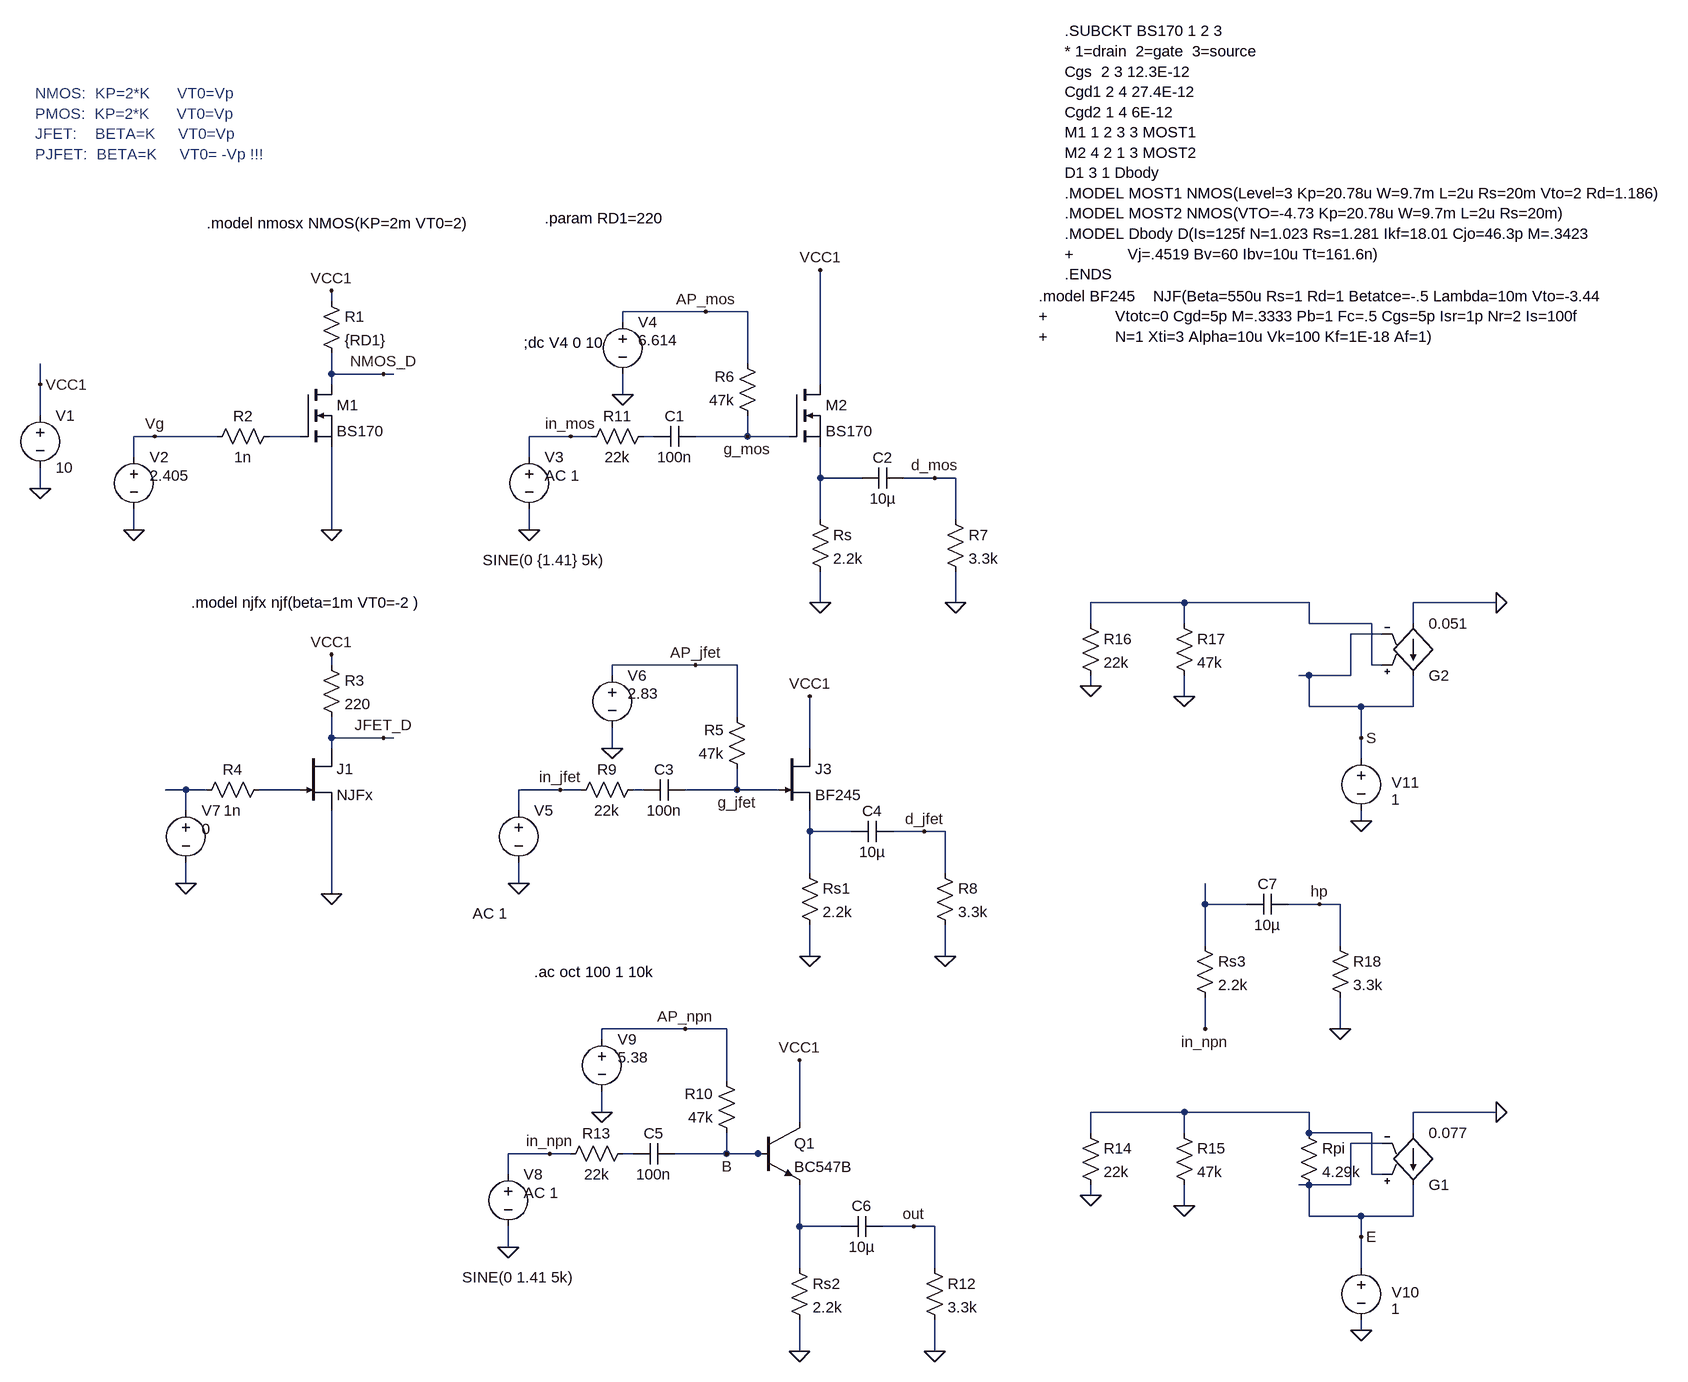
[diagram p0: schematic Sourcefolger.asc]
Sourcefolger.asc, the LTspice schematic file:
Version 4
SHEET 1 3376 2448
WIRE 1184 160 1184 144
WIRE 1760 176 1632 176
WIRE 1824 176 1760 176
WIRE 1632 192 1632 176
WIRE 1824 256 1824 176
WIRE 1184 272 1184 240
WIRE 1264 272 1184 272
WIRE 1280 272 1264 272
WIRE 736 288 736 256
WIRE 1184 288 1184 272
WIRE 1936 288 1936 112
WIRE 1632 304 1632 272
WIRE 736 336 736 288
WIRE 912 368 880 368
WIRE 1008 368 912 368
WIRE 1136 368 1088 368
WIRE 1552 368 1488 368
WIRE 1584 368 1552 368
WIRE 1680 368 1664 368
WIRE 1824 368 1824 336
WIRE 1824 368 1744 368
WIRE 1888 368 1824 368
WIRE 880 400 880 368
WIRE 1488 400 1488 368
WIRE 1936 432 1936 384
WIRE 2000 432 1936 432
WIRE 2112 432 2064 432
WIRE 2144 432 2112 432
WIRE 736 448 736 416
WIRE 1936 496 1936 432
WIRE 2144 496 2144 432
WIRE 880 512 880 480
WIRE 1184 512 1184 384
WIRE 1488 512 1488 480
WIRE 1936 624 1936 576
WIRE 2144 624 2144 576
WIRE 2496 624 2352 624
WIRE 2688 624 2496 624
WIRE 2976 624 2848 624
WIRE 2352 656 2352 624
WIRE 2496 656 2496 624
WIRE 2688 656 2688 624
WIRE 2784 656 2688 656
WIRE 2848 656 2848 624
WIRE 2800 672 2752 672
WIRE 1184 720 1184 704
WIRE 1744 720 1616 720
WIRE 1808 720 1744 720
WIRE 2784 720 2784 656
WIRE 2800 720 2784 720
WIRE 1616 736 1616 720
WIRE 2688 736 2672 736
WIRE 2752 736 2752 672
WIRE 2752 736 2688 736
WIRE 2352 752 2352 736
WIRE 2496 768 2496 736
WIRE 2688 784 2688 736
WIRE 2768 784 2688 784
WIRE 2848 784 2848 736
WIRE 2848 784 2768 784
WIRE 1808 800 1808 720
WIRE 1184 832 1184 800
WIRE 1264 832 1184 832
WIRE 1280 832 1264 832
WIRE 2768 832 2768 784
WIRE 1184 848 1184 832
WIRE 1616 848 1616 816
WIRE 1920 848 1920 768
WIRE 2768 864 2768 832
WIRE 960 912 928 912
WIRE 992 912 960 912
WIRE 1136 912 1072 912
WIRE 1536 912 1472 912
WIRE 1568 912 1536 912
WIRE 1664 912 1648 912
WIRE 1808 912 1808 880
WIRE 1808 912 1728 912
WIRE 1872 912 1808 912
WIRE 960 944 960 912
WIRE 1472 944 1472 912
WIRE 2768 960 2768 944
WIRE 1920 976 1920 944
WIRE 1984 976 1920 976
WIRE 2096 976 2048 976
WIRE 2128 976 2096 976
WIRE 1920 1040 1920 976
WIRE 2128 1040 2128 976
WIRE 960 1056 960 1024
WIRE 1472 1056 1472 1024
WIRE 1184 1072 1184 944
WIRE 2528 1088 2528 1056
WIRE 2592 1088 2528 1088
WIRE 2704 1088 2656 1088
WIRE 2736 1088 2704 1088
WIRE 2528 1152 2528 1088
WIRE 2736 1152 2736 1088
WIRE 1920 1168 1920 1120
WIRE 2128 1168 2128 1120
WIRE 1728 1280 1600 1280
WIRE 1792 1280 1728 1280
WIRE 2528 1280 2528 1232
WIRE 2736 1280 2736 1232
WIRE 1600 1296 1600 1280
WIRE 1792 1360 1792 1280
WIRE 1600 1408 1600 1376
WIRE 2496 1408 2352 1408
WIRE 2688 1408 2496 1408
WIRE 2976 1408 2848 1408
WIRE 1904 1424 1904 1328
WIRE 2352 1440 2352 1408
WIRE 2496 1440 2496 1408
WIRE 2688 1440 2688 1408
WIRE 2784 1440 2688 1440
WIRE 2848 1440 2848 1408
WIRE 2800 1456 2752 1456
WIRE 1520 1472 1456 1472
WIRE 1552 1472 1520 1472
WIRE 1648 1472 1632 1472
WIRE 1792 1472 1792 1440
WIRE 1792 1472 1712 1472
WIRE 1840 1472 1792 1472
WIRE 1856 1472 1840 1472
WIRE 1456 1504 1456 1472
WIRE 2784 1504 2784 1440
WIRE 2800 1504 2784 1504
WIRE 2688 1520 2672 1520
WIRE 2752 1520 2752 1456
WIRE 2752 1520 2688 1520
WIRE 2352 1536 2352 1520
WIRE 2496 1552 2496 1520
WIRE 2688 1568 2688 1520
WIRE 2768 1568 2688 1568
WIRE 2848 1568 2848 1520
WIRE 2848 1568 2768 1568
WIRE 1904 1584 1904 1520
WIRE 1968 1584 1904 1584
WIRE 2080 1584 2032 1584
WIRE 2112 1584 2080 1584
WIRE 2768 1600 2768 1568
WIRE 1456 1616 1456 1584
WIRE 1904 1648 1904 1584
WIRE 2112 1648 2112 1584
WIRE 2768 1648 2768 1600
WIRE 2768 1744 2768 1728
WIRE 1904 1776 1904 1728
WIRE 2112 1776 2112 1728
FLAG 1184 512 0
FLAG 736 448 0
FLAG 880 512 0
FLAG 736 288 VCC1
FLAG 1184 144 VCC1
FLAG 1184 1072 0
FLAG 1184 704 VCC1
FLAG 912 368 Vg
FLAG 1264 832 JFET_D
FLAG 1264 272 NMOS_D
FLAG 1936 624 0
FLAG 1488 512 0
FLAG 1936 112 VCC1
FLAG 1632 304 0
FLAG 1760 176 AP_mos
FLAG 1824 368 g_mos
FLAG 2112 432 d_mos
FLAG 1552 368 in_mos
FLAG 2144 624 0
FLAG 960 1056 0
FLAG 1920 1168 0
FLAG 1472 1056 0
FLAG 1920 768 VCC1
FLAG 1616 848 0
FLAG 1744 720 AP_jfet
FLAG 1808 912 g_jfet
FLAG 2096 976 d_jfet
FLAG 1536 912 in_jfet
FLAG 2128 1168 0
FLAG 1904 1776 0
FLAG 1456 1616 0
FLAG 1904 1328 VCC1
FLAG 1600 1408 0
FLAG 1728 1280 AP_npn
FLAG 1792 1472 B
FLAG 2080 1584 out
FLAG 1520 1472 in_npn
FLAG 2112 1776 0
FLAG 2496 1552 0
FLAG 2352 1536 0
FLAG 2976 1408 0
FLAG 2768 1744 0
FLAG 2496 768 0
FLAG 2352 752 0
FLAG 2976 624 0
FLAG 2768 960 0
FLAG 2768 1600 E
FLAG 2768 832 S
FLAG 2704 1088 hp
FLAG 2736 1280 0
FLAG 2528 1280 in_npn
SYMBOL voltage 736 320 R0
WINDOW 123 0 0 Left 2
WINDOW 39 0 0 Left 2
SYMATTR InstName V1
SYMATTR Value 10
SYMBOL res 1168 144 R0
SYMATTR InstName R1
SYMATTR Value {RD1}
SYMBOL voltage 880 384 R0
WINDOW 123 0 0 Left 2
WINDOW 39 0 0 Left 2
WINDOW 3 24 44 Left 2
SYMATTR Value 2.405
SYMATTR InstName V2
SYMBOL res 1104 352 R90
WINDOW 0 0 56 VBottom 2
WINDOW 3 32 56 VTop 2
SYMATTR InstName R2
SYMATTR Value 1n
SYMBOL nmos 1136 288 R0
SYMATTR InstName M1
SYMATTR Value BS170
SYMATTR Prefix X
SYMBOL njf 1136 848 R0
SYMATTR InstName J1
SYMATTR Value NJFx
SYMBOL res 1168 704 R0
SYMATTR InstName R3
SYMATTR Value 220
SYMBOL res 1088 896 R90
WINDOW 0 0 56 VBottom 2
WINDOW 3 32 56 VTop 2
SYMATTR InstName R4
SYMATTR Value 1n
SYMBOL voltage 1488 384 R0
WINDOW 123 24 44 Left 2
WINDOW 39 0 0 Left 2
WINDOW 3 -71 174 Left 2
SYMATTR Value2 AC 1
SYMATTR Value SINE(0 {1.41} 5k)
SYMATTR InstName V3
SYMBOL res 1840 352 R180
WINDOW 0 36 76 Left 2
WINDOW 3 36 40 Left 2
SYMATTR InstName R6
SYMATTR Value 47k
SYMBOL cap 1744 352 R90
WINDOW 0 0 32 VBottom 2
WINDOW 3 32 32 VTop 2
SYMATTR InstName C1
SYMATTR Value 100n
SYMBOL voltage 1632 176 R0
WINDOW 123 0 0 Left 2
WINDOW 39 0 0 Left 2
WINDOW 3 24 44 Left 2
SYMATTR Value 6.614
SYMATTR InstName V4
SYMBOL cap 2064 416 R90
WINDOW 0 0 32 VBottom 2
WINDOW 3 32 32 VTop 2
SYMATTR InstName C2
SYMATTR Value 10µ
SYMBOL res 2128 480 R0
SYMATTR InstName R7
SYMATTR Value 3.3k
SYMBOL nmos 1888 288 R0
SYMATTR InstName M2
SYMATTR Value BS170
SYMATTR Prefix X
SYMBOL voltage 960 928 R0
WINDOW 123 0 0 Left 2
WINDOW 39 0 0 Left 2
WINDOW 3 24 44 Left 2
SYMATTR Value 0
SYMATTR InstName V7
SYMBOL res 1680 352 R90
WINDOW 0 0 56 VBottom 2
WINDOW 3 32 56 VTop 2
SYMATTR InstName R11
SYMATTR Value 22k
SYMBOL res 1920 480 R0
SYMATTR InstName Rs
SYMATTR Value 2.2k
SYMBOL voltage 1472 928 R0
WINDOW 123 0 0 Left 2
WINDOW 39 0 0 Left 2
WINDOW 3 -71 174 Left 2
SYMATTR Value AC 1
SYMATTR InstName V5
SYMBOL res 1824 896 R180
WINDOW 0 36 76 Left 2
WINDOW 3 36 40 Left 2
SYMATTR InstName R5
SYMATTR Value 47k
SYMBOL cap 1728 896 R90
WINDOW 0 0 32 VBottom 2
WINDOW 3 32 32 VTop 2
SYMATTR InstName C3
SYMATTR Value 100n
SYMBOL voltage 1616 720 R0
WINDOW 123 0 0 Left 2
WINDOW 39 0 0 Left 2
WINDOW 3 24 44 Left 2
SYMATTR Value 2.83
SYMATTR InstName V6
SYMBOL cap 2048 960 R90
WINDOW 0 0 32 VBottom 2
WINDOW 3 32 32 VTop 2
SYMATTR InstName C4
SYMATTR Value 10µ
SYMBOL res 2112 1024 R0
SYMATTR InstName R8
SYMATTR Value 3.3k
SYMBOL res 1664 896 R90
WINDOW 0 0 56 VBottom 2
WINDOW 3 32 56 VTop 2
SYMATTR InstName R9
SYMATTR Value 22k
SYMBOL res 1904 1024 R0
SYMATTR InstName Rs1
SYMATTR Value 2.2k
SYMBOL voltage 1456 1488 R0
WINDOW 123 24 44 Left 2
WINDOW 39 0 0 Left 2
WINDOW 3 -71 174 Left 2
SYMATTR Value2 AC 1
SYMATTR Value SINE(0 1.41 5k)
SYMATTR InstName V8
SYMBOL res 1808 1456 R180
WINDOW 0 36 76 Left 2
WINDOW 3 36 40 Left 2
SYMATTR InstName R10
SYMATTR Value 47k
SYMBOL cap 1712 1456 R90
WINDOW 0 0 32 VBottom 2
WINDOW 3 32 32 VTop 2
SYMATTR InstName C5
SYMATTR Value 100n
SYMBOL voltage 1600 1280 R0
WINDOW 123 0 0 Left 2
WINDOW 39 0 0 Left 2
WINDOW 3 24 44 Left 2
SYMATTR Value 5.38
SYMATTR InstName V9
SYMBOL cap 2032 1568 R90
WINDOW 0 0 32 VBottom 2
WINDOW 3 32 32 VTop 2
SYMATTR InstName C6
SYMATTR Value 10µ
SYMBOL res 2096 1632 R0
SYMATTR InstName R12
SYMATTR Value 3.3k
SYMBOL res 1648 1456 R90
WINDOW 0 0 56 VBottom 2
WINDOW 3 32 56 VTop 2
SYMATTR InstName R13
SYMATTR Value 22k
SYMBOL res 1888 1632 R0
SYMATTR InstName Rs2
SYMATTR Value 2.2k
SYMBOL npn 1840 1424 R0
SYMATTR InstName Q1
SYMATTR Value BC547B
SYMBOL njf 1872 848 R0
SYMATTR InstName J3
SYMATTR Value BF245
SYMBOL res 2336 1424 R0
SYMATTR InstName R14
SYMATTR Value 22k
SYMBOL res 2480 1424 R0
SYMATTR InstName R15
SYMATTR Value 47k
SYMBOL res 2672 1424 R0
SYMATTR InstName Rpi
SYMATTR Value 4.29k
SYMBOL g 2848 1536 M180
SYMATTR InstName G1
SYMATTR Value 0.077
SYMBOL voltage 2768 1632 R0
WINDOW 123 0 0 Left 2
WINDOW 39 0 0 Left 2
WINDOW 3 46 79 Left 2
WINDOW 0 47 53 Left 2
SYMATTR Value 1
SYMATTR InstName V10
SYMBOL res 2336 640 R0
SYMATTR InstName R16
SYMATTR Value 22k
SYMBOL res 2480 640 R0
SYMATTR InstName R17
SYMATTR Value 47k
SYMBOL g 2848 752 M180
SYMATTR InstName G2
SYMATTR Value 0.051
SYMBOL voltage 2768 848 R0
WINDOW 123 0 0 Left 2
WINDOW 39 0 0 Left 2
WINDOW 3 46 79 Left 2
WINDOW 0 47 53 Left 2
SYMATTR Value 1
SYMATTR InstName V11
SYMBOL cap 2656 1072 R90
WINDOW 0 0 32 VBottom 2
WINDOW 3 32 32 VTop 2
SYMATTR InstName C7
SYMATTR Value 10µ
SYMBOL res 2720 1136 R0
SYMATTR InstName R18
SYMATTR Value 3.3k
SYMBOL res 2512 1136 R0
SYMATTR InstName Rs3
SYMATTR Value 2.2k
TEXT 992 40 Left 2 !.model nmosx NMOS(KP=2m VT0=2)
TEXT 968 624 Left 2 !.model njfx njf(beta=1m VT0=-2 )
TEXT 728 -160 Left 2 ;NMOS:  KP=2*K      VT0=Vp\nPMOS:  KP=2*K      VT0=Vp\nJFET:    BETA=K     VT0=Vp\nPJFET:  BETA=K     VT0= -Vp !!!
TEXT 1512 32 Left 2 !.param RD1=220
TEXT 2312 -256 Left 2 !.SUBCKT BS170 1 2 3\n* 1=drain  2=gate  3=source\nCgs  2 3 12.3E-12\nCgd1 2 4 27.4E-12\nCgd2 1 4 6E-12\nM1 1 2 3 3 MOST1\nM2 4 2 1 3 MOST2\nD1 3 1 Dbody\n.MODEL MOST1 NMOS(Level=3 Kp=20.78u W=9.7m L=2u Rs=20m Vto=2 Rd=1.186)\n.MODEL MOST2 NMOS(VTO=-4.73 Kp=20.78u W=9.7m L=2u Rs=20m)\n.MODEL Dbody D(Is=125f N=1.023 Rs=1.281 Ikf=18.01 Cjo=46.3p M=.3423\n+            Vj=.4519 Bv=60 Ibv=10u Tt=161.6n)\n.ENDS
TEXT 2272 152 Left 2 !.model BF245    NJF(Beta=550u Rs=1 Rd=1 Betatce=-.5 Lambda=10m Vto=-3.44\n+               Vtotc=0 Cgd=5p M=.3333 Pb=1 Fc=.5 Cgs=5p Isr=1p Nr=2 Is=100f\n+               N=1 Xti=3 Alpha=10u Vk=100 Kf=1E-18 Af=1)
TEXT 1496 1192 Left 2 !.ac oct 100 1 10k
TEXT 1480 224 Left 2 !;dc V4 0 10

The netlist it stands for:
* Sourcefolger.asc
V1 VCC1 0 10
R1 VCC1 NMOS_D {RD1}
V2 Vg 0 2.405
R2 N001 Vg 1n
XM1 NMOS_D N001 0 BS170  ; pins D G S
J1 JFET_D N006 0 NJFx
R3 VCC1 JFET_D 220
R4 N006 N005 1n
V3 in_mos 0 SINE(0 {1.41} 5k) AC 1
R6 g_mos AP_mos 47k
C1 g_mos N002 100n
V4 AP_mos 0 6.614
C2 d_mos N003 10µ
R7 d_mos 0 3.3k
XM2 VCC1 g_mos N003 BS170  ; pins D G S
V7 N005 0 0
R11 N002 in_mos 22k
Rs N003 0 2.2k
V5 in_jfet 0 AC 1
R5 g_jfet AP_jfet 47k
C3 g_jfet N007 100n
V6 AP_jfet 0 2.83
C4 d_jfet N008 10µ
R8 d_jfet 0 3.3k
R9 N007 in_jfet 22k
Rs1 N008 0 2.2k
V8 in_npn 0 SINE(0 1.41 5k) AC 1
R10 B AP_npn 47k
C5 B N011 100n
V9 AP_npn 0 5.38
C6 out N012 10µ
R12 out 0 3.3k
R13 N011 in_npn 22k
Rs2 N012 0 2.2k
Q1 VCC1 B N012 0 BC547B
J3 VCC1 g_jfet N008 BF245
R14 N010 0 22k
R15 N010 0 47k
Rpi N010 E 4.29k
G1 0 E N010 E 0.077
V10 E 0 1
R16 N004 0 22k
R17 N004 0 47k
G2 0 S N004 S 0.051
V11 S 0 1
C7 hp N009 10µ
R18 hp 0 3.3k
Rs3 N009 in_npn 2.2k
.model NPN NPN
.model PNP PNP
.lib standard.bjt
.model NJF NJF
.model PJF PJF
.lib standard.jft
.model nmosx NMOS(KP=2m VT0=2)
.model njfx njf(beta=1m VT0=-2 )
* NMOS:  KP=2*K      VT0=Vp
* PMOS:  KP=2*K      VT0=Vp
* JFET:    BETA=K     VT0=Vp
* PJFET:  BETA=K     VT0= -Vp !!!
.param RD1=220
.SUBCKT BS170 1 2 3
* 1=drain  2=gate  3=source
Cgs  2 3 12.3E-12
Cgd1 2 4 27.4E-12
Cgd2 1 4 6E-12
M1 1 2 3 3 MOST1
M2 4 2 1 3 MOST2
D1 3 1 Dbody
.MODEL MOST1 NMOS(Level=3 Kp=20.78u W=9.7m L=2u Rs=20m Vto=2 Rd=1.186)
.MODEL MOST2 NMOS(VTO=-4.73 Kp=20.78u W=9.7m L=2u Rs=20m)
.MODEL Dbody D(Is=125f N=1.023 Rs=1.281 Ikf=18.01 Cjo=46.3p M=.3423
+            Vj=.4519 Bv=60 Ibv=10u Tt=161.6n)
.ENDS
.model BF245    NJF(Beta=550u Rs=1 Rd=1 Betatce=-.5 Lambda=10m Vto=-3.44
+               Vtotc=0 Cgd=5p M=.3333 Pb=1 Fc=.5 Cgs=5p Isr=1p Nr=2 Is=100f
+               N=1 Xti=3 Alpha=10u Vk=100 Kf=1E-18 Af=1)
.ac oct 100 1 10k
;dc V4 0 10
.backanno
.end